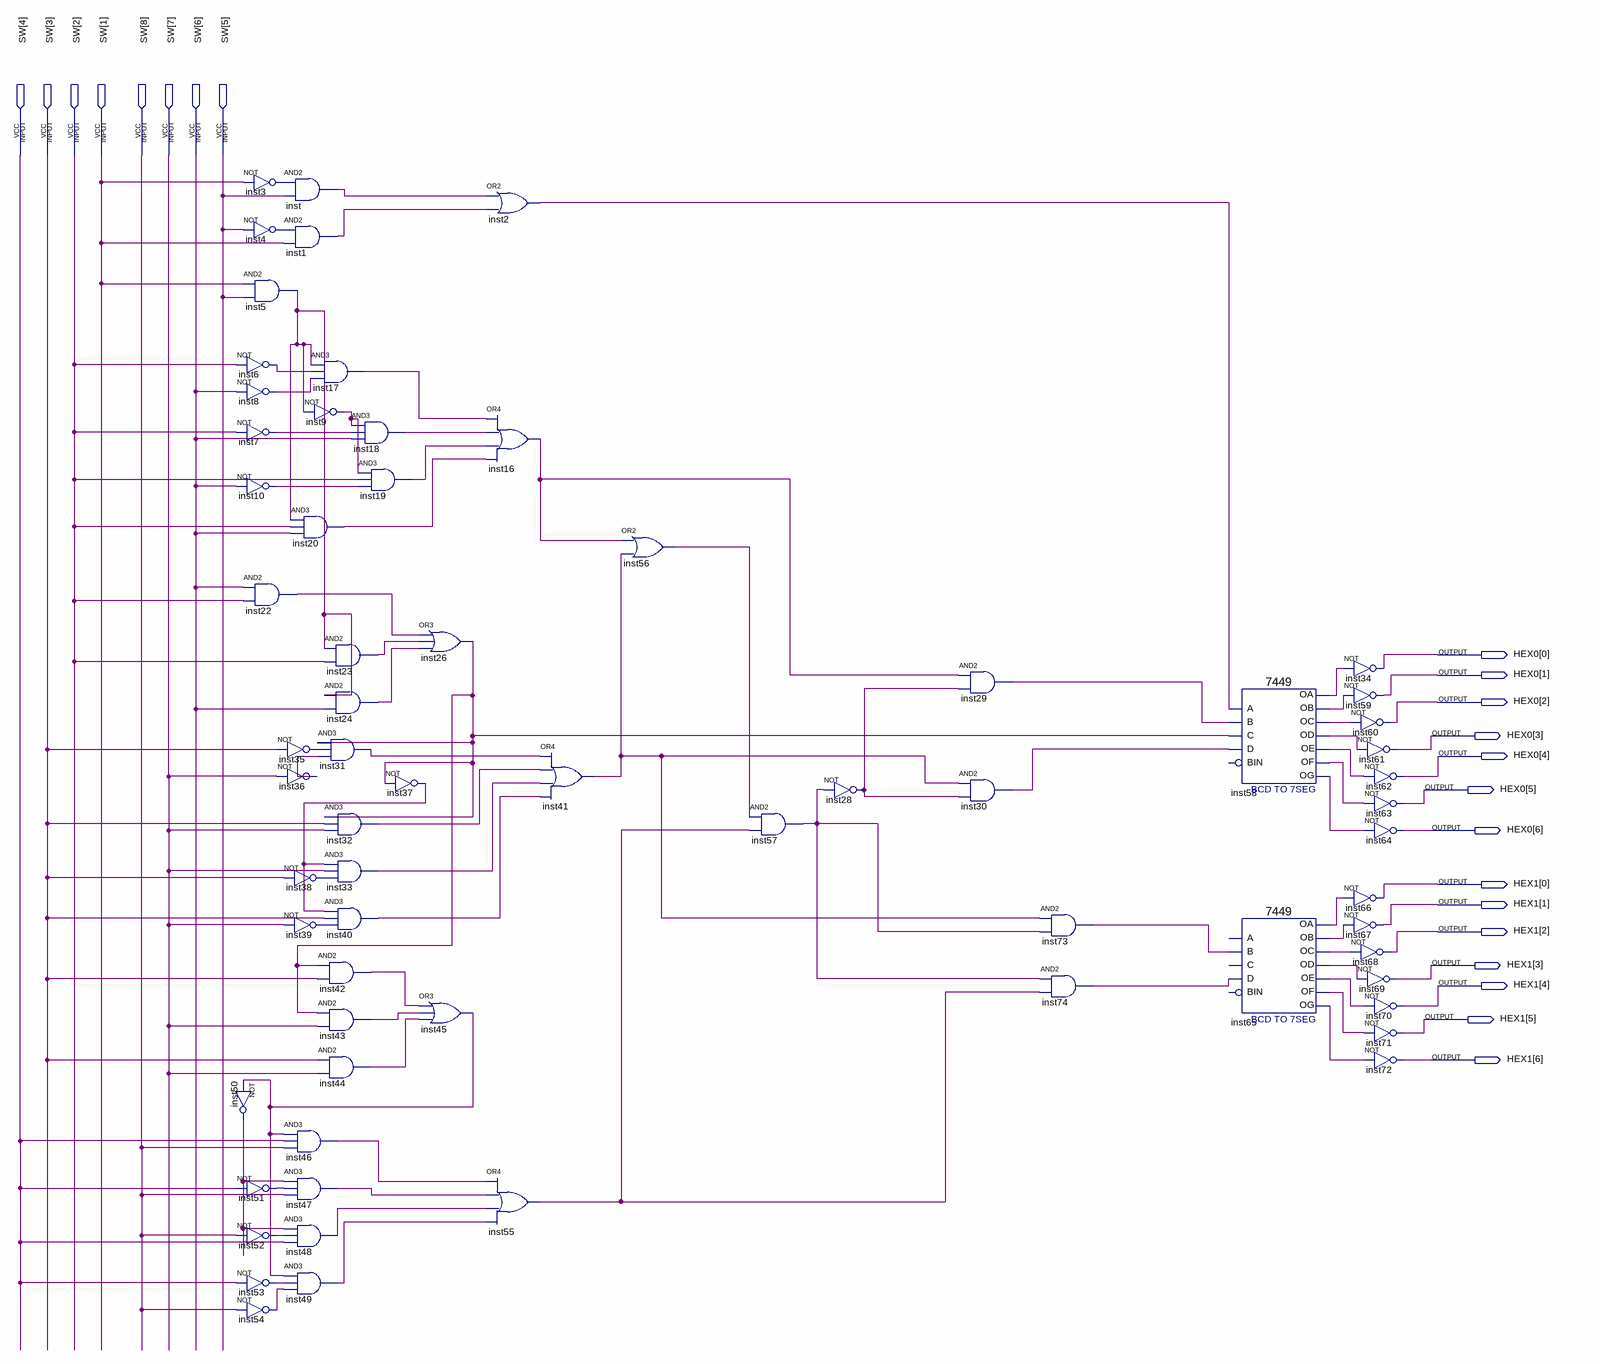
[diagram p0: schematic sheet]
// Quartus schematic MeioSomadorCompleto.bdf as structural Verilog: 67 symbols, 22 pins
module MeioSomadorCompleto (
  input  [8:1] SW,
  output [6:0] HEX0,
  output [6:0] HEX1
);

  wire inst1_out, inst2_out, inst3_out, inst4_out, inst5_out, inst6_out, inst7_out, inst8_out, inst9_out,
       inst10_out, inst16_out, inst17_out, inst18_out, inst19_out, inst20_out, inst22_out, inst23_out,
       inst24_out, inst26_out, inst28_out, inst29_out, inst30_out, inst31_out, inst32_out, inst33_out,
       inst35_out, inst36_out, inst37_out, inst38_out, inst39_out, inst40_out, inst41_out, inst42_out,
       inst43_out, inst44_out, inst45_out, inst46_out, inst47_out, inst48_out, inst49_out, inst50_out,
       inst51_out, inst52_out, inst53_out, inst54_out, inst55_out, inst56_out, inst57_out, inst58_oa,
       inst58_ob, inst58_oc, inst58_od, inst58_oe, inst58_of, inst58_og, inst65_oa, inst65_ob, inst65_oc,
       inst65_od, inst65_oe, inst65_of, inst65_og, inst73_out, inst74_out, inst_out;

  not inst3 (inst3_out, SW[1]);
  not inst4 (inst4_out, SW[5]);
  and inst5 (inst5_out, SW[1], SW[5]);
  not inst6 (inst6_out, SW[2]);
  not inst8 (inst8_out, SW[6]);
  not inst7 (inst7_out, SW[2]);
  not inst10 (inst10_out, SW[6]);
  and inst22 (inst22_out, SW[6], SW[2]);
  not inst50 (inst50_out, inst45_out);
  not inst51 (inst51_out, SW[4]);
  not inst52 (inst52_out, SW[8]);
  not inst53 (inst53_out, SW[4]);
  not inst54 (inst54_out, SW[8]);
  and inst (inst_out, inst3_out, SW[5]);
  and inst1 (inst1_out, inst4_out, SW[1]);
  and inst20 (inst20_out, inst5_out, SW[2], SW[6]);
  not inst35 (inst35_out, SW[3]);
  not inst36 (inst36_out, SW[7]);
  not inst38 (inst38_out, SW[3]);
  not inst39 (inst39_out, SW[7]);
  and inst46 (inst46_out, inst45_out, SW[4], SW[8]);
  and inst47 (inst47_out, inst50_out, inst51_out, SW[8]);
  and inst48 (inst48_out, inst50_out, inst52_out, SW[4]);
  and inst49 (inst49_out, inst45_out, inst53_out, inst54_out);
  and inst17 (inst17_out, inst5_out, inst6_out, inst8_out);
  not inst9 (inst9_out, inst5_out);
  and inst18 (inst18_out, inst9_out, inst7_out, SW[6]);
  and inst23 (inst23_out, inst5_out, SW[2]);
  and inst24 (inst24_out, inst5_out, SW[6]);
  and inst31 (inst31_out, inst26_out, inst35_out, inst36_out);
  and inst32 (inst32_out, inst26_out, SW[3], SW[7]);
  and inst33 (inst33_out, inst37_out, SW[7], inst38_out);
  and inst40 (inst40_out, inst37_out, SW[3], inst39_out);
  and inst42 (inst42_out, inst26_out, SW[3]);
  and inst43 (inst43_out, inst26_out, SW[7]);
  and inst44 (inst44_out, SW[3], SW[7]);
  and inst19 (inst19_out, inst9_out, SW[2], inst10_out);
  not inst37 (inst37_out, inst26_out);
  or inst26 (inst26_out, inst22_out, inst23_out, inst24_out);
  or inst45 (inst45_out, inst42_out, inst43_out, inst44_out);
  or inst2 (inst2_out, inst_out, inst1_out);
  or inst16 (inst16_out, inst17_out, inst18_out, inst19_out, inst20_out);
  or inst55 (inst55_out, inst46_out, inst47_out, inst48_out, inst49_out);
  or inst41 (inst41_out, inst31_out, inst32_out, inst33_out, inst40_out);
  or inst56 (inst56_out, inst16_out, inst41_out);
  and inst57 (inst57_out, inst56_out, inst55_out);
  not inst28 (inst28_out, inst57_out);
  and inst29 (inst29_out, inst16_out, inst28_out);
  and inst30 (inst30_out, inst41_out, inst28_out);
  and inst73 (inst73_out, inst41_out, inst57_out);
  and inst74 (inst74_out, inst57_out, inst55_out);
  \7449  inst58 (
    .A(inst2_out), .C(inst26_out), .B(inst29_out), .D(inst30_out), .OC(inst58_oc), .OD(inst58_od),
    .OF(inst58_of), .OG(inst58_og), .OB(inst58_ob), .OA(inst58_oa), .OE(inst58_oe));  // open: BIN
  \7449  inst65 (
    .B(inst73_out), .D(inst74_out), .OC(inst65_oc), .OD(inst65_od), .OF(inst65_of), .OG(inst65_og),
    .OB(inst65_ob), .OA(inst65_oa), .OE(inst65_oe));  // open: A, C, BIN
  not inst34 (HEX0[0], inst58_oa);
  not inst59 (HEX0[1], inst58_ob);
  not inst60 (HEX0[2], inst58_oc);
  not inst61 (HEX0[3], inst58_od);
  not inst62 (HEX0[4], inst58_oe);
  not inst63 (HEX0[5], inst58_of);
  not inst64 (HEX0[6], inst58_og);
  not inst66 (HEX1[0], inst65_oa);
  not inst67 (HEX1[1], inst65_ob);
  not inst68 (HEX1[2], inst65_oc);
  not inst69 (HEX1[3], inst65_od);
  not inst70 (HEX1[4], inst65_oe);
  not inst71 (HEX1[5], inst65_of);
  not inst72 (HEX1[6], inst65_og);
endmodule
